# Altium schematic sheet Connectors.SchDoc
size A; SheetNumber: 9; SheetTotal: 9
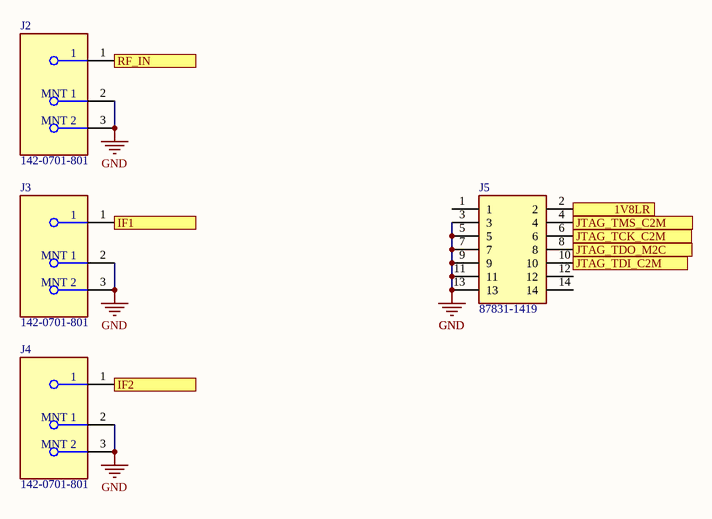
[diagram p0: Connectors.SchDoc]

## Parts
J2  142-0701-801  [FP-142-0701-801-MFG]
J3  142-0701-801  [FP-142-0701-801-MFG]
J4  142-0701-801  [FP-142-0701-801-MFG]
J5  87831-1419  [SHDR14W55P200_2X7_1665X630X640P]

## Ports
1V8LR (in), IF1 (in), IF2 (in), JTAG_TCK_C2M (out), JTAG_TDI_C2M (out), JTAG_TDO_M2C (in), JTAG_TMS_C2M (out), RF_IN (out)

## Nets
GND: J2.2(MNT_1) J2.3(MNT_2) J3.2(MNT_1) J3.3(MNT_2) J4.2(MNT_1) J4.3(MNT_2) J5.3 J5.5 J5.7 J5.9 J5.11 J5.13
1V8LR: J5.2 ; port 1V8LR
IF1: J3.1 ; port IF1
IF2: J4.1 ; port IF2
JTAG_TCK_C2M: J5.6 ; port JTAG_TCK_C2M
JTAG_TDI_C2M: J5.10 ; port JTAG_TDI_C2M
JTAG_TDO_M2C: J5.8 ; port JTAG_TDO_M2C
JTAG_TMS_C2M: J5.4 ; port JTAG_TMS_C2M
RF_IN: J2.1 ; port RF_IN

Not connected (* = marked no-connect by the designer): J5 1 12 14

## Library data of the parts
J2-J4 = CMP-09588-000002-1: CONN SMA JACK STR 50OHM EDGE MNT; Frequency: 18GHz; Operating Frequency: 0 to 18 GHz; Body Material: Brass; Impedance: 50R; Voltage Rating: 335V; Gender: Female; Body Plating: Gold; Orientation: Straight; Length: 0.44inch; Max Operating Temperature: 165°C; Package Quantity: 5; Packaging: Bulk; Series: SMA; Contact Material: Copper; Min Operating Temperature: -65°C; Depth: 25.58mm; RoHS Compliant: Yes; Case/Package: SMA; Max Frequency: 18GHz; Radiation Hardening: No; Contact Plating: Gold; Mount: Edge; Connector Type: SMA; Fastening Type: Threaded; Termination: Solder
J5 = 87831-1419: Connector; Manufacturer_Name: Molex; Datasheet Link: https://componentsearchengine.com/Datasheets/1/87831-1419.pdf; Height: 6.4mm; Manufacturer_Part_Number: 87831-1419; Mouser Part Number: 538-87831-1419; Mouser Price/Stock: https://www.mouser.co.uk/ProductDetail/Molex/87831-1419?qs=6BVwEky2YVwe7CvCRRAl0Q%3D%3D